# EasyEDA Pro project ProPrj_SPF5043_2025-07-16.epro

# Schematic Schematic1
Board Name: Board1; Create Date: 2025-07-16; Page Name: P1; Project Name: SPF5043; Schematic Name: Schematic1; Update Date: 2025-07-16; Company: 嘉立创EDA; Page Size: A4; Version: V1.0
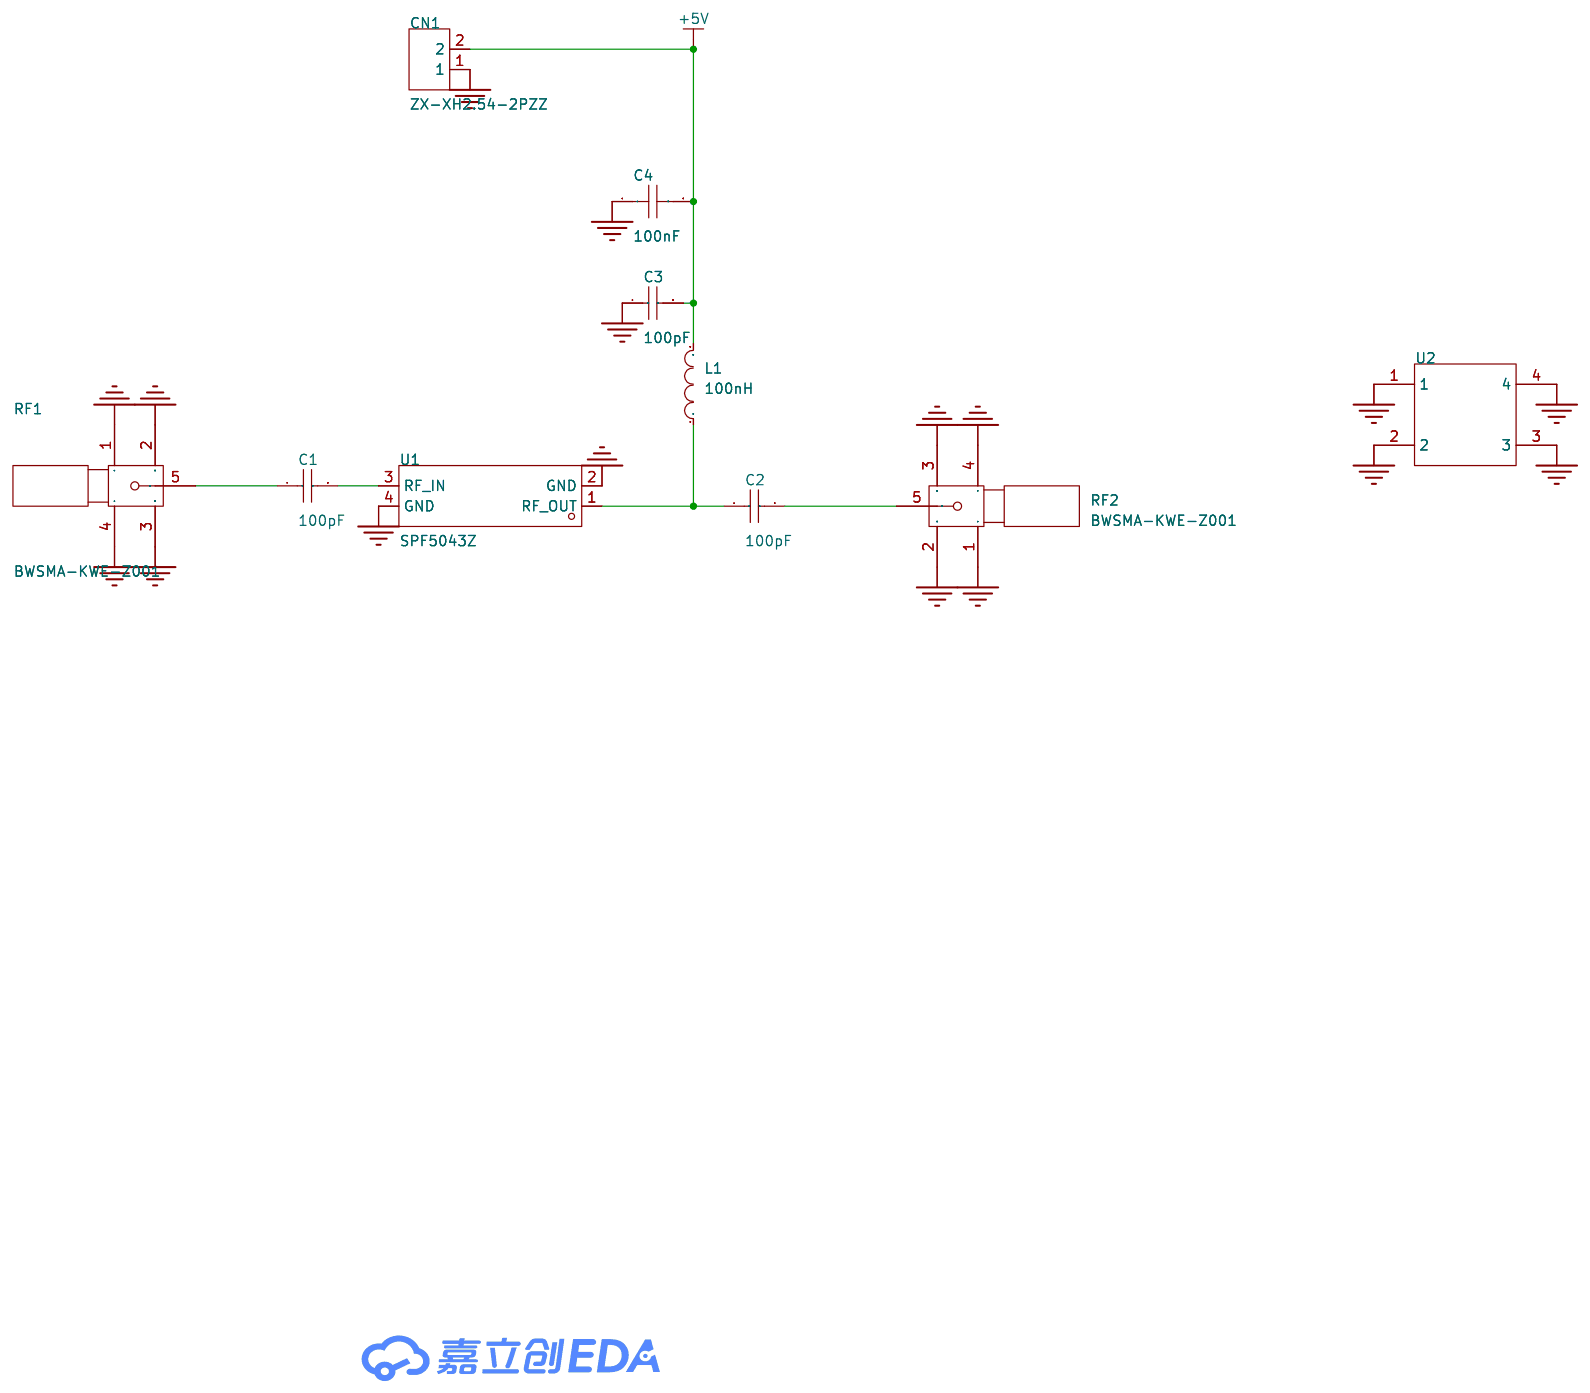
[diagram p0: schematic sheet]

## Parts
C1  100pF  [C0603]
C2  100pF  [C0603]
C3  100pF  [C0603]
C4  100nF  [C0603]
CN1  ZX-XH2.54-2PZZ  [CONN-TH_2P-P2.50_HX25003-2A]
L1  100nH  [L0603]
RF1  BWSMA-KWE-Z001  [SMA-TH_BWSMA-KWE-Z001]
RF2  BWSMA-KWE-Z001  [SMA-TH_BWSMA-KWE-Z001]
U1  SPF5043Z  [SOT343_L2.0-W1.3-P1.30-LS2.1-BL]
U2  -  [22x17x6]

## Library data of the parts
C1-C3 = CL10C101JB8NNNC: 容值:100pF;精度:±5%;额定电压:50V;材质(温度系数):C0G;; LCSC Part Name: 100pF ±5% 50V; Supplier Part: C14858; Manufacturer: SAMSUNG(三星); Supplier Footprint: 0603; JLCPCB Part Class: 基础库; Datasheet: https://atta.szlcsc.com/upload/public/pdf/source/20160218/1457707763339.pdf; Supplier: LCSC; Tolerance: ±5%; Voltage Rated: 50V; Temperature Coefficient: C0G
C4 = CC0603KRX7R9BB104: 容值:100nF;精度:±10%;额定电压:50V;温度系数:X7R;; LCSC Part Name: 100nF ±10% 50V; Supplier Part: C14663; Manufacturer: YAGEO(国巨); Supplier Footprint: 0603; JLCPCB Part Class: 基础库; Datasheet: https://atta.szlcsc.com/upload/public/pdf/source/20250214/096C4C206003071F5D32E5F0D8E7F8DF.pdf; Supplier: LCSC; Tolerance: ±10%; Voltage Rating: 50V; Temperature Coefficient: X7R
CN1 = ZX-XH2.54-2PZZ: 插针结构:1x2P;间距:2.5mm;安装方式:直插;参考系列:XH;总PIN数:2P;排数:1;每排PIN数:2;行距:-;额定电流:3A;触头材质:黄铜;触头镀层:锡;工作温度:-25℃~+85℃;; LCSC Part Name: 1x2P 间距:2.5mm 直插 系列:XH; Supplier Part: C7429632; Manufacturer: Megastar(兆星); Supplier Footprint: 插件,P=2.5mm; JLCPCB Part Class: 扩展库; Datasheet: https://atta.szlcsc.com/upload/public/pdf/source/20230619/19BA6947230AA44A04D3EDD65E618FD0.pdf; Supplier: LCSC; Pins Structure: 1x2P; Pitch: 2.5mm; Mounting Type: 直插; Reference Series: XH; Number of Pins: 2P; Number of Rows: 1; Number of PINs Per Row: 2; Current Rating: 3A; Contact Material: 黄铜; Contact Plating: 锡; Operating Temperature: -25℃~+85℃; Voltage Rating: 250V; Plastic Material: PA66; Flame Retardant Rating: UL94V-0; Color: 白色; Z-Height of the Board: 7mm; X-Length of Bottom Edge on Board (Spacing Line): 7.5mm; Y-Width of Bottom Edge on Board: 5.9mm
L1 = VHF160808HR10JT: 电感值:100nH;精度:±5%;额定电流:200mA;饱和电流(Isat):-;直流电阻(DCR):1.4Ω;; LCSC Part Name: 100nH ±5%; Supplier Part: C90214; Manufacturer: FH(风华); Supplier Footprint: 0603; JLCPCB Part Class: 扩展库; Datasheet: https://atta.szlcsc.com/upload/public/pdf/source/20230223/8EF545BE87E825DABED9AF3380ABCE94.pdf; Supplier: LCSC; Tolerance: ±5%; Rated Current: 200mA; DC Resistance (DCR): 1.4Ω
RF1 RF2 = BWSMA-KWE-Z001: 连接器类型:板端;接口类型:内孔;端口数量:1;接口直径:5.3mm;接口长度/高度:-;频率-最大值:-;射频系列:SMA;阻抗:50Ω;样式:弯头;触头材质:-;触头镀层:-;工作温度范围:-;焊接温度(最大值):-;; LCSC Part Name: 内孔 SMA 弯头; Supplier Part: C496551; Manufacturer: BAT WIRELESS(蝙蝠无线); Supplier Footprint: 插件; JLCPCB Part Class: 扩展库; Datasheet: https://atta.szlcsc.com/upload/public/pdf/source/20231017/997A8C2ADA7F8034A89BE1264F38CE52.pdf; Supplier: LCSC; Connector Type: 板端; Interface Type: 内孔; Number of Ports: 1; Interface Diameter: 5.3mm; RF Series: SMA; Impedance: 50Ω; Style: 弯头
U1 = SPF5043Z: 应用领域:手机；W-CDMA；ISM；LTE；PCS;频率:50MHz~4GHz;增益:18.2dB;噪声系数:0.8dB;; LCSC Part Name: 50 MHz至4000 MHz低噪声放大器; Supplier Part: C470902; Manufacturer: Qorvo; Supplier Footprint: SOT-343; JLCPCB Part Class: 扩展库; Datasheet: https://atta.szlcsc.com/upload/public/pdf/source/20191217/C470902_43E9B3153BCFA8173359C8BD5196C3C8.pdf; Supplier: LCSC; Applications: 手机；W-CDMA；ISM；LTE；PCS; Frequency Range: 50MHz~4GHz; Gain: 18.2dB; Noise Figure: 0.8dB; Voltage - Supply: 4.75V~5.25V; Operating Temperature: -40℃~+85℃
U2 = 22x17x6

## Nets
+5V: C3.2 C4.2 CN1.2 L1.2
GND: C3.1 C4.1 CN1.1 RF1.1 RF1.2 RF1.3 RF1.4 RF2.1 RF2.2 RF2.3 RF2.4 U1.2(GND) U1.4(GND) U2.1 U2.2 U2.3 U2.4
Net-(C1-1): C1.1 RF1.5
Net-(C1-2): C1.2 U1.3(RF_IN)
Net-(C2-1): C2.1 L1.1 U1.1(RF_OUT)
Net-(C2-2): C2.2 RF2.5

# Board PCB1
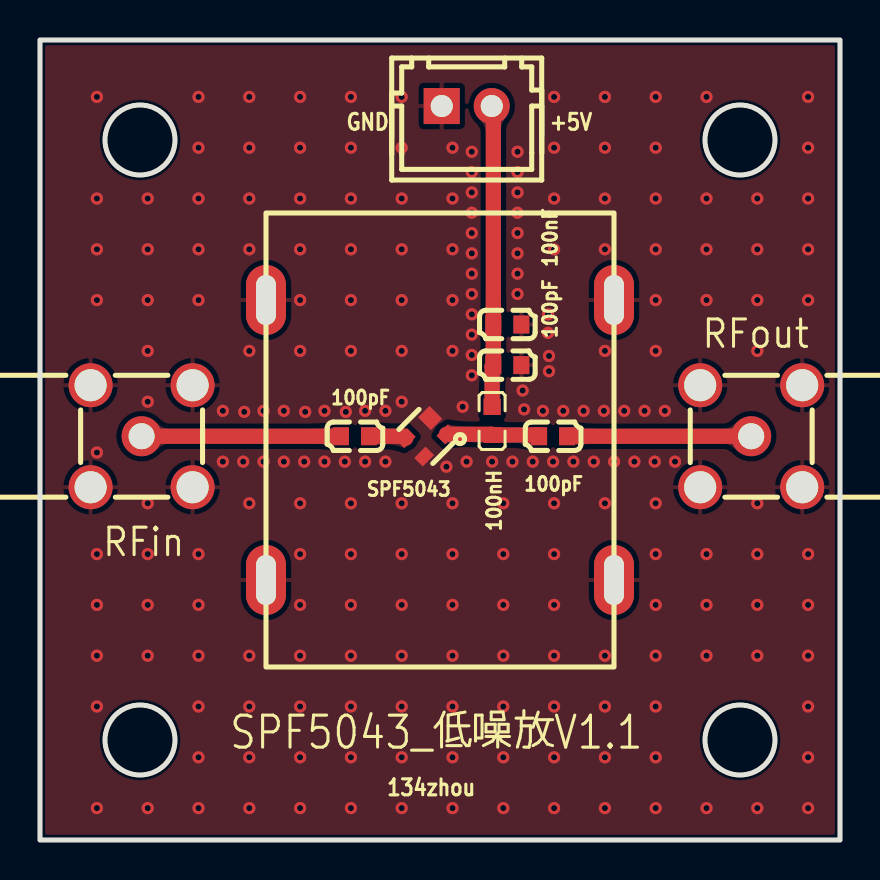
[diagram p1: board, top side]
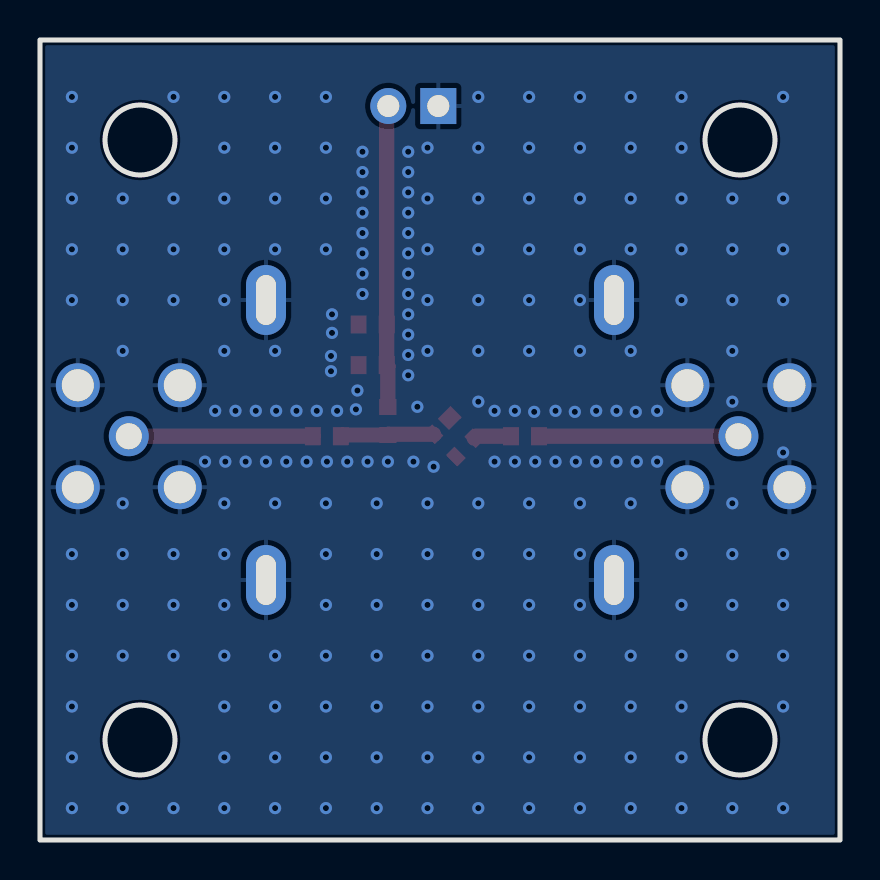
[diagram p2: board, bottom side, seen from below]

Outline 40 x 40 mm; copper layers: Top Layer, Bottom Layer. Coordinates in mm from the lower left corner of the outline.
Outline path: rectangle 0,40 40,0 ; circle c5,35 r1.75 ; circle c5,5 r1.75 ; circle c35,35 r1.75 ; circle c35,5 r1.75
Stack: Top Layer 0.035mm / Dielectric1 1.51mm FR4 er 4.5 / Bottom Layer 0.035mm

## Design rules (mm)
template: JLCPCB Capability(Two Layers Board)
spacing copperThickness1oz (default): track to track 0.102, other pairs 0.152 to 0.3
spacing copperThickness2oz: track to track 0.203, other pairs 0.152 to 0.3
track width copperThickness1oz (default): min 0.127, default 0.254, max 2.54
track width copperThickness2oz: min 0.203, default 0.254, max 2.54
differential pair differentialPair (default): width min 0.127, default 0.254, max 2.54; gap min 0.152, default 0.152
via viaSize (default): diameter min 0.5, default 0.61, max 10; hole min 0.3, default 0.305, max 6.3

## Placement (name value [footprint] x y rotation side)
100nF  100nF  [C0603]  23.37 25.78 180 top
100nH  100nH  [L0603]  22.61 20.95 90 top
100pF  -  [C0603]  25.65 20.19 0 top
100pF#2  -  [C0603]  15.75 20.19 0 top
100pF#3  -  [C0603]  23.37 23.74 180 top
CN1  ZX-XH2.54-2PZZ  [CONN-TH_2P-P2.50_HX25003-2A]  21.34 36.7 0 top
RFin  BWSMA-KWE-Z001  [SMA-TH_BWSMA-KWE-Z001]  5.08 20.19 180 top
RFout  BWSMA-KWE-Z001  [SMA-TH_BWSMA-KWE-Z001]  35.56 20.19 0 top
SPF5043  SPF5043Z  [SOT343_L2.0-W1.3-P1.30-LS2.1-BL]  19.3 20.19 135 top
U2  -  [22x17x6]  20 20 90 top

## Footprints (pads in the part's own frame, mm; a bottom-side part is the same pattern mirrored in y, then rotated)
22x17x6
  oval 3.5x2 hole 2.5x1: 1(-7,-8.7) 2(7,-8.7) 3(7,8.7) 4(-7,8.7)
C0603
  rect 0.8x0.9 smd: 1(-0.7,0) 2(0.7,0)
CONN-TH_2P-P2.50_HX25003-2A
  rect 1.8x1.8 hole 1.1: 1(-1.25,0)
  round 1.8 hole 1.1: 2(1.25,0)
L0603
  rect 0.8x0.864 smd: 1(-0.7,0) 2(0.7,0)
SMA-TH_BWSMA-KWE-Z001
  round 2.2 hole 1.6: 1(-2.55,-2.55) 2(-2.55,2.55) 3(2.55,2.55) 4(2.55,-2.55)
  round 2 hole 1.3: 5(0,0)
SOT343_L2.0-W1.3-P1.30-LS2.1-BL
  rect 0.6x0.8 smd: 1(-0.65,-0.788) 3(0.65,0.788) 4(-0.65,0.788)
  rect 0.899x0.8 smd: 2(0.5,-0.788)

## Nets
+5V: 100nF.2 100nH.2 100pF#3.2 CN1.2
GND: 100nF.1 100pF#3.1 CN1.1 RFin.1 RFin.2 RFin.3 RFin.4 RFout.1 RFout.2 RFout.3 RFout.4 SPF5043.2 SPF5043.4 U2.1 U2.2 U2.3 U2.4
$1N251: 100pF#2.2 SPF5043.3
$1N287: 100nH.1 100pF.1 SPF5043.1
$1N858: 100pF#2.1 RFin.5
$1N912: 100pF.2 RFout.5

## Via types
v1: diameter 0.61, hole 0.305, Top Layer to Bottom Layer, 226 vias

## Routing (per net, layer and track width the routed paths; a pad name or vN(x,y) marks a point on that pad's centre or on a via; arc(x,y) is an arc through that point)
+5V: length 15.1
  Top Layer w0.762: CN1.2 22.67,36.62 100nF.2 100pF#3.2 22.61,23.68 100nH.2
GND:
  vias: v1(2.84,37.16) v1(2.84,32.08) v1(2.84,29.53) v1(2.84,27) v1(2.84,19.38) v1(2.84,14.3) v1(2.84,11.75) v1(2.84,9.22) v1(2.84,6.67) v1(2.84,1.59) v1(5.38,32.08) v1(5.38,29.53) v1(5.38,27) v1(5.38,24.45) v1(5.38,21.92) v1(5.38,16.83) v1(5.38,14.3) v1(5.38,11.75) v1(5.38,9.22) v1(5.38,1.59) v1(7.93,37.16) v1(7.93,34.61) v1(7.93,32.08) v1(7.93,29.53) v1(7.93,27) v1(7.93,14.3) v1(7.93,11.75) v1(7.93,9.22) v1(7.93,6.67) v1(7.93,4.14) v1(7.93,1.59) v1(9.14,21.46) v1(9.14,18.92) v1(10.21,21.41) v1(10.16,18.92) v1(10.47,37.16) v1(10.47,34.61) v1(10.47,32.08) v1(10.47,29.53) v1(10.47,24.45) v1(10.47,16.83) v1(10.47,9.22) v1(10.47,6.67) v1(10.47,4.14) v1(10.47,1.59) v1(11.18,21.46) v1(11.18,18.92) v1(12.19,21.46) v1(12.19,18.92) v1(13,37.16) v1(13,34.61) v1(13,32.08) v1(13,29.53) v1(13,27) v1(13,24.45) v1(13,16.83) v1(13,14.3) v1(13,11.75) v1(13,9.22) v1(13,6.67) v1(13,4.14) v1(13,1.59) v1(13.21,18.92) v1(13.26,21.41) v1(14.22,21.46) v1(14.22,18.92) v1(15.24,18.92) v1(15.29,21.41) v1(15.54,37.16) v1(15.54,34.61) v1(15.54,32.08) v1(15.54,29.53) v1(15.54,27) v1(15.54,24.45) v1(15.54,16.83) v1(15.54,14.3) v1(15.54,11.75) v1(15.54,9.22) v1(15.54,6.67) v1(15.54,4.14) v1(15.54,1.59) v1(16.26,21.46) v1(16.26,18.92) v1(17.27,21.46) v1(17.27,18.92) v1(18.09,37.16) v1(18.09,34.61) v1(18.09,32.08) v1(18.09,29.53) v1(18.09,27) v1(18.09,24.45) v1(18.09,21.92) v1(18.09,16.83) v1(18.09,14.3) v1(18.09,11.75) v1(18.09,9.22) v1(18.09,6.67) v1(18.09,4.14) v1(18.09,1.59) v1(20.32,18.66) v1(20.62,34.61) v1(20.62,32.08) v1(20.62,29.53) v1(20.62,27) v1(20.62,24.45) v1(20.62,16.83) v1(20.62,14.3) v1(20.62,11.75) v1(20.62,9.22) v1(20.62,6.67) v1(20.62,4.14) v1(20.62,1.59) v1(21.13,21.66) v1(21.33,18.92) v1(21.59,34.41) v1(21.59,33.4) v1(21.59,32.38) v1(21.59,31.36) v1(21.59,30.35) v1(21.59,29.33) v1(21.59,28.32) v1(21.59,27.3) v1(21.59,26.28) v1(21.59,25.27) v1(21.59,24.25) v1(21.59,23.24) v1(22.61,18.92) v1(23.16,16.83) v1(23.16,14.3) v1(23.16,11.75) v1(23.16,9.22) v1(23.16,6.67) v1(23.16,4.14) v1(23.16,1.59) v1(23.62,18.92) v1(23.88,34.41) v1(23.88,33.4) v1(23.88,32.38) v1(23.88,31.36) v1(23.88,30.35) v1(23.88,29.33) v1(23.88,28.32) v1(23.88,27.3) v1(24.13,22.47) v1(24.2,21.53) v1(24.64,18.92) v1(25.15,21.46) v1(25.4,26.28) v1(25.4,25.36) v1(25.45,24.2) v1(25.45,23.44) v1(25.71,37.16) v1(25.71,34.61) v1(25.71,32.08) v1(25.71,29.53) v1(25.65,18.92) v1(25.71,16.83) v1(25.71,14.3) v1(25.71,11.75) v1(25.71,9.22) v1(25.71,6.67) v1(25.71,4.14) v1(25.71,1.59) v1(26.16,21.46) v1(26.67,18.92) v1(27.18,21.46) v1(27.69,18.92) v1(28.25,37.16) v1(28.25,34.61) v1(28.25,32.08) v1(28.25,29.53) v1(28.25,24.45) v1(28.19,21.46) v1(28.25,16.83) v1(28.25,9.22) v1(28.25,6.67) v1(28.25,4.14) v1(28.25,1.59) v1(28.7,18.92) v1(29.21,21.46) v1(29.72,18.92) v1(30.23,21.46) v1(30.73,18.92) v1(30.78,37.16) v1(30.78,34.61) v1(30.78,32.08) v1(30.78,29.53) v1(30.78,27) v1(30.78,24.45) v1(30.78,16.83) v1(30.78,14.3) v1(30.78,11.75) v1(30.78,9.22) v1(30.78,6.67) v1(30.78,4.14) v1(30.78,1.59) v1(31.24,21.46) v1(31.75,18.92) v1(33.32,37.16) v1(33.32,32.08) v1(33.32,29.53) v1(33.32,27) v1(33.32,14.3) v1(33.32,11.75) v1(33.32,9.22) v1(33.32,1.59) v1(35.87,32.08) v1(35.87,29.53) v1(35.87,27) v1(35.87,24.45) v1(35.87,16.83) v1(35.87,14.3) v1(35.87,11.75) v1(35.87,9.22) v1(35.87,1.59) v1(38.41,37.16) v1(38.41,34.61) v1(38.41,32.08) v1(38.41,29.53) v1(38.41,27) v1(38.41,14.3) v1(38.41,11.75) v1(38.41,9.22) v1(38.41,6.67) v1(38.41,4.14) v1(38.41,1.59)
$1N251: length 1.9
  Top Layer w0.762: 100pF#2.2 18.19,20.19 SPF5043.3
$1N287: length 4.7
  Top Layer w0.762: SPF5043.1 22.57,20.29 100nH.1 24.89,20.25 100pF.1
$1N858: length 10
  Top Layer w0.762: RFin.5 100pF#2.1
$1N912: length 9.2
  Top Layer w0.762: 100pF.2 RFout.5

## Copper pours and planes (outline as drawn; the poured copper is in the pictures)
GND on Top Layer: -4.57,45.84 46.48,45.84 46.48,-2.93 -4.57,-2.93
GND on Bottom Layer: -9.65,41.78 50.04,41.78 50.04,-7.24 -9.65,-7.24

Small or netless copper shapes (teardrops, artwork), in the pictures only: 16 on Top Layer

## Text on the board
Top Silkscreen Layer: GND | 134zhou | +5V | SPF5043_低噪放V1.1
